# Altium schematic sheet Motor_Controller.SchDoc
size A
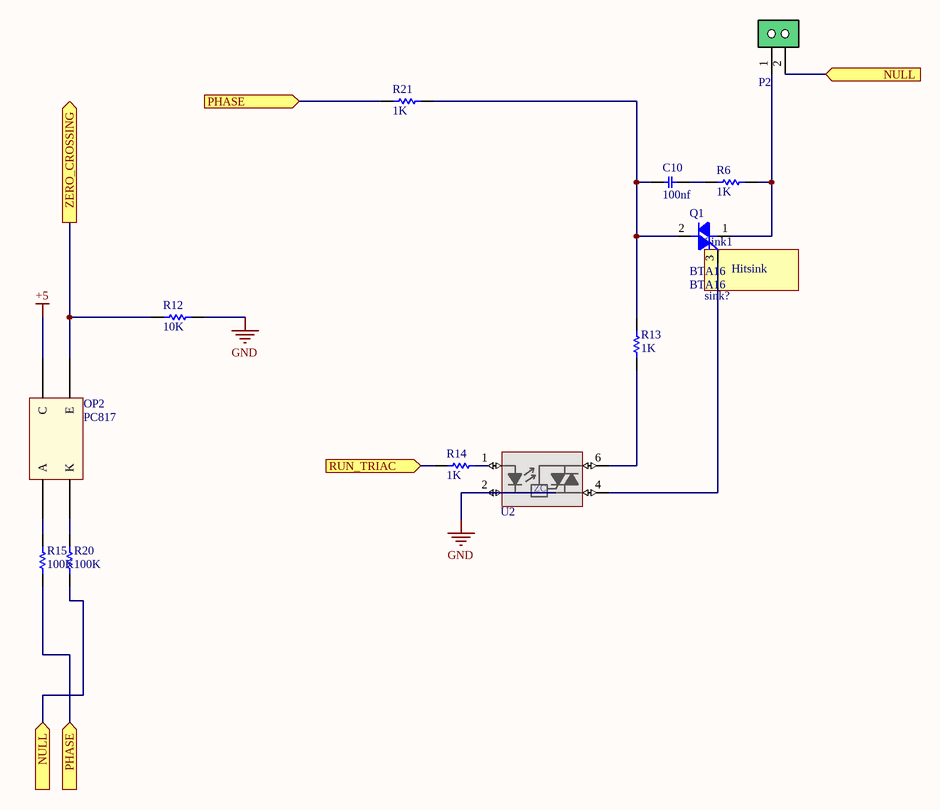
[diagram p0: Motor_Controller.SchDoc]

## Parts
C10  value 100nf  [C_PLY_13X5]  (hidden comment: Capacitor Polyester THD)
OP2  PC817  [PC817 SMD]
P2  Phoenix 2  [PRKR2A]  (value not drawn)
Q1  BTA16  [TO220]
R6  value 1K  [R05W_AX05]  (hidden comment: Resistor THD)
R12  value 10K  [SMD-1206-RES]  (hidden comment: Resistor SMD 1206)
R13  value 1K  [SMD-1206-RES]  (hidden comment: Resistor SMD 1206)
R14  value 1K  [SMD-1206-RES]  (hidden comment: Resistor SMD 1206)
R15  value 100K  [R2W_AX08]  (hidden comment: Resistor THD)
R20  value 100K  [R2W_AX08]  (hidden comment: Resistor THD)
R21  value 1K  [SMD-1206-RES]  (hidden comment: Resistor SMD 1206)
Sink1  sink?  [heatsink (4)]
U2  MOC30XX  [DIP-6 white]  (value not drawn)

## Ports
NULL (in), PHASE (in), RUN_TRIAC (in), ZERO_CROSSING (out)

## Nets
+5: OP2.4(C)
GND: R12.2 U2.2(K)
NULL: P2.2 R20.1 ; port NULL
PHASE: R15.1 R21.1 ; port PHASE
RUN_TRIAC: R14.1 ; port RUN_TRIAC
ZERO_CROSSING: OP2.3(E) R12.1 ; port ZERO_CROSSING
NetC10_1: C10.1 Q1.2(T2) R13.2 R21.2
NetC10_2: C10.2 R6.1
NetOP2_1: OP2.1(A) R15.2
NetOP2_2: OP2.2(K) R20.2
NetP2_1: P2.1 Q1.1(T1) R6.2
NetQ1_3: Q1.3(G) U2.4(T2)
NetR13_1: R13.1 U2.6(T1)
NetR14_2: R14.2 U2.1(A)

## Notes on the sheet
- (in symbol MOC30XX) ZC

## Library data of the parts
OP2 = PC817: PC817 optocpler; ComponentLink2Description: Website Smart World; ComponentLink2URL: https://www.smartw.ir/; ComponentLink3Description: Telegram; ComponentLink3URL: https://t.me/altium_smartw; ComponentLink4Description: Instagram; ComponentLink4URL: https://Instagram.com/smartgw.ir; DatasheetVersion: 2021
Q1 = BTA16: Triac, 800V, 16A, TO-220; ComponentLink1Description: Website Smart World; ComponentLink1URL: https://www.smartw.ir/; ComponentLink2Description: Telegram; ComponentLink2URL: https://t.me/altium_smartw; ComponentLink3Description: Instagram; ComponentLink3URL: https://Instagram.com/smartgw.ir; DatasheetVersion: 2021; VALUE: BTA16
Sink1 = Hitsink
U2 = MOC30XX: Single Channel Zero-Crossing Random-Phase Optoisolators Triac Driver (600 Volt Peak) , Isolation Voltage 7500Vac(pk); ComponentLink1Description: Website Smart World; ComponentLink1URL: https://www.smartw.ir/; ComponentLink2Description: Telegram; ComponentLink2URL: https://t.me/altium_smartw; ComponentLink3Description: Instagram; ComponentLink3URL: https://Instagram.com/smartgw.ir; DatasheetVersion: 2021
C10 = Capacitor Polyester THD: DatasheetVersion: 2021; ComponentLink1Description: Website Smart World; ComponentLink1URL: https://www.smartw.ir/; ComponentLink2Description: Telegram; ComponentLink2URL: https://t.me/altium_smartw; ComponentLink3Description: Instagram; ComponentLink3URL: https://Instagram.com/smartgw.ir
P2 = Phoenix 2: ComponentLinkp-URL: https://www.smartw.ir/; DatasheetVersion: 2021; ComponentLink1Description: Website Smart World; ComponentLink1URL: https://www.smartw.ir/; ComponentLink2Description: Telegram; ComponentLink2URL: https://t.me/altium_smartw; ComponentLink3Description: Instagram; ComponentLink3URL: https://Instagram.com/smartgw.ir
R6 R15 R20 = Resistor THD: DatasheetVersion: 2021; ComponentLink1Description: Website Smart World; ComponentLink1URL: https://www.smartw.ir/; ComponentLink2Description: Telegram; ComponentLink2URL: https://t.me/altium_smartw; ComponentLink3Description: Instagram; ComponentLink3URL: https://Instagram.com/smartgw.ir
R12-R14 R21 = Resistor SMD 1206: DatasheetVersion: 2021; ComponentLink1Description: Website Smart World; ComponentLink1URL: https://www.smartw.ir/; ComponentLink2Description: Telegram; ComponentLink2URL: https://t.me/altium_smartw; ComponentLink3Description: Instagram; ComponentLink3URL: https://Instagram.com/smartgw.ir